# Altium project PCB_asurt.PrjPcb
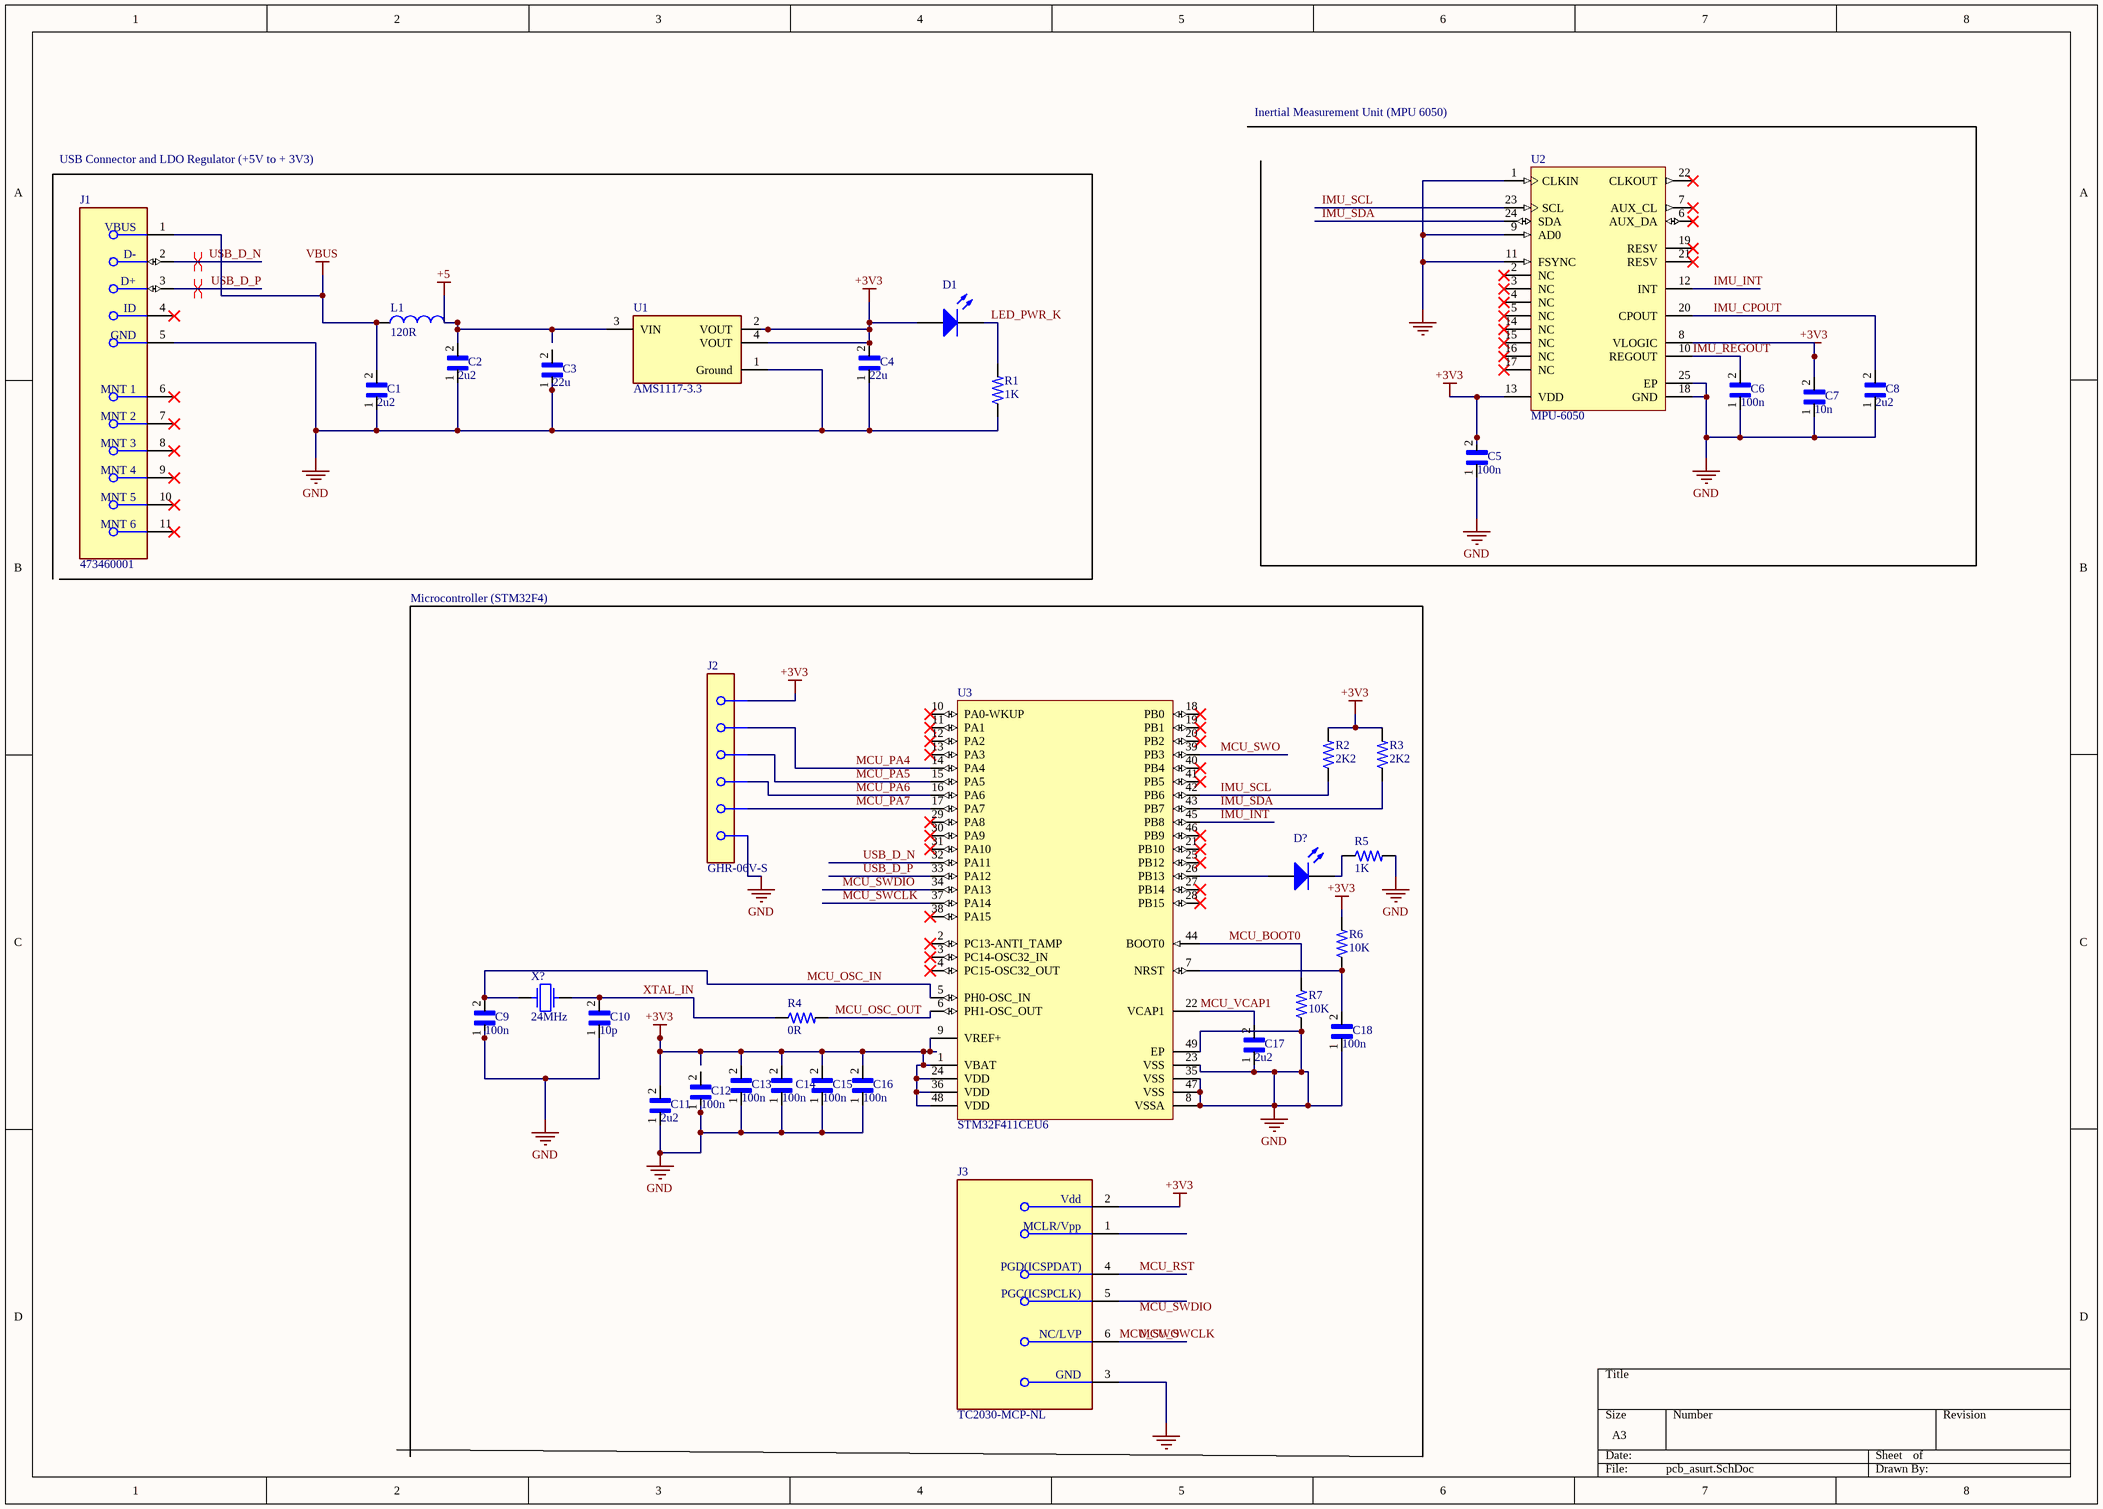
[diagram p0: pcb_asurt.SchDoc]
1 sheet, 35 parts. Net scope: global (net labels, ports and power ports of the same name join across sheets).
Board file: PCB1.PcbDoc

## Sheet pcb_asurt.SchDoc
size A3; SheetNumber: 1; SheetTotal: 1

### Parts
C1  2u2  [CAPRR1000W60L1260T920H1390]
C2  2u2  [CAPRR1000W60L1260T920H1390]
C3  22u  [CAPRR1000W60L1260T920H1390]
C4  22u  [CAPRR1000W60L1260T920H1390]
C5  100n  [CAPRR1000W60L1260T920H1390]
C6  100n  [CAPRR1000W60L1260T920H1390]
C7  10n  [CAPRR1000W60L1260T920H1390]
C8  2u2  [CAPRR1000W60L1260T920H1390]
C9  100n  [CAPRR1000W60L1260T920H1390]
C10  10p  [CAPRR1000W60L1260T920H1390]
C11  2u2  [CAPRR1000W60L1260T920H1390]
C12  100n  [CAPRR1000W60L1260T920H1390]
C13  100n  [CAPRR1000W60L1260T920H1390]
C14  100n  [CAPRR1000W60L1260T920H1390]
C15  100n  [CAPRR1000W60L1260T920H1390]
C16  100n  [CAPRR1000W60L1260T920H1390]
C17  2u2  [CAPRR1000W60L1260T920H1390]
C18  100n  [CAPRR1000W60L1260T920H1390]
D1  Light-Emitting Diode  (value not drawn)
D?  Light-Emitting Diode  (value not drawn)
J1  473460001  [FP-473460001-MFG]
J2  GHR-06V-S  [FP-GHR-06V-S-MFG]
J3  TC2030-MCP-NL  [FP-TC2030-MCP-NL-MFG]
L1  value 120R  (hidden comment: Inductor)
R1  1K  [RESC1005X35N]
R2  2K2  [RESC1005X35N]
R3  2K2  [RESC1005X35N]
R4  0R  [RESC1005X35N]
R5  1K  [RESC1005X35N]
R6  10K  [RESC1005X35N]
R7  10K  [RESC1005X35N]
U1  AMS1117-3.3  [FP-AMS1117-IPC_C]
U2  MPU-6050  [IS-QFN-24_V]
U3  STM32F411CEU6  [STM-UFQFPN48_L]
X?  F0: 24MHz  (hidden comment: Crystal)

### Nets
+3V3: C4.2 C5.2 C7.2 C11.2 C13.2 C14.2 C15.2 C16.2 D1.1(A) J3.2(Vdd) J3.3(GND) R2.2 R3.2 R6.2 U1.2(VOUT) U1.4(VOUT) U2.1(CLKIN) U2.8(VLOGIC) U2.9(AD0) U2.11(FSYNC) U2.13(VDD) U3.1(VBAT) U3.9(VREF+) U3.24(VDD) U3.36(VDD) U3.48(VDD)
+5: C2.2 L1.2 U1.3(VIN)
GND: C1.1 C2.1 C3.1 C4.1 C5.1 C6.1 C7.1 C8.1 C9.1 C10.1 C11.1 C12.1 C13.1 C14.1 C15.1 C16.1 C17.1 C18.1 J1.5(GND) R1.1 R5.2 R7.1 U1.1(Ground) U2.18(GND) U2.25(EP) U3.8(VSSA) U3.23(VSS) U3.35(VSS) U3.47(VSS) U3.49(EP)
VBUS: C1.2 J1.1(VBUS) L1.1
IMU_CPOUT: C8.2 U2.20(CPOUT)
IMU_INT: U2.12(INT) U3.45(PB8)
IMU_REGOUT: C6.2 U2.10(REGOUT)
IMU_SCL: R2.1 U2.23(SCL) U3.42(PB6)
IMU_SDA: R3.1 U2.24(SDA) U3.43(PB7)
LED_PWR_K: D1.2(K) R1.2
MCU_BOOT0: R7.2 U3.44(BOOT0)
MCU_OSC_IN: C9.2 U3.5(PH0-OSC_IN) X?.2
MCU_OSC_OUT: R4.2 U3.6(PH1-OSC_OUT)
MCU_PA4: U3.14(PA4)
MCU_PA5: U3.15(PA5)
MCU_PA6: U3.16(PA6)
MCU_PA7: U3.17(PA7)
MCU_RST: J3.4(PGD(ICSPDAT))
MCU_SWCLK: J3.6(NC/LVP) U3.37(PA14) U3.39(PB3)  [also labelled MCU_SWO]
MCU_SWDIO: U3.34(PA13)
MCU_VCAP1: C17.2 U3.22(VCAP1)
USB_D_N: J1.2(D-) U3.32(PA11)
USB_D_P: J1.3(D+) U3.33(PA12)
XTAL_IN: C10.2 R4.1 X?.1
NetC18_2: C18.2 R6.1 U3.7(NRST)
NetD?_1: D?.1(A) U3.26(PB13)
NetD?_2: D?.2(K) R5.1

Not connected (* = marked no-connect by the designer): C3 2; C12 2; J1 4(ID)* 6(MNT_1)* 7(MNT_2)* 8(MNT_3)* 9(MNT_4)* 10(MNT_5)* 11(MNT_6)*; J3 1(MCLR/Vpp) 5(PGC(ICSPCLK)); U2 2(NC)* 3(NC)* 4(NC)* 5(NC)* 6(AUX_DA)* 7(AUX_CL)* 14(NC)* 15(NC)* 16(NC)* 17(NC)* 19(RESV)* 21(RESV)* 22(CLKOUT)*; U3 2(PC13-ANTI_TAMP)* 3(PC14-OSC32_IN)* 4(PC15-OSC32_OUT)* 10(PA0-WKUP)* 11(PA1)* 12(PA2)* 13(PA3)* 18(PB0)* 19(PB1)* 20(PB2)* 21(PB10)* 25(PB12)* 27(PB14)* 28(PB15)* 29(PA8)* 30(PA9)* 31(PA10)* 38(PA15)* 40(PB4)* 41(PB5)* 46(PB9)*

### Layout directives
differential pair; differential pair class *DIFF_USB: USB_D_N, USB_D_P

### Notes on the sheet
- USB Connector and LDO Regulator (+5V to + 3V3)
- Inertial Measurement Unit (MPU 6050)
- Microcontroller (STM32F4)
- Labels drawn without touching a wire or pin: MCU_SWDIO

### Library data of the parts
C1-C18 = ECWFD2W105Q1: Price: None; Availability: Unavailable; Package: None; MP: ECWFD2W105Q1; Value: *
D1 D? = LED: AF: 1; BV: 0; BV_MAX: 1e99; EG: 1.11; FC: 0.5; IBV: 0.001; IS: 1e-14; MJSW: 0.33; NTUN: 30; TNOM: 27; XTI: 3; SimulationGenericComponent: True; CJO: 0; CJP: 0; CTA: 0; CTP: 0; FCS: 0.5; FV_MAX: 1e99; IKF: 0; IKR: 0; ISR: 1e-14; JSW: 0; JTUN: 0; JTUNSW: 0; KEG: 1; KF: 0; LEVEL: 1; N: 1; NBV: 1; NR: 1; NS: 1; PHP: 1; RS: 0; TCV: 0; TLEV: 0; TLEVC: 0; TM1: 0; TM2: 0; TPB: 0; TPHP: 0; TRS: 0; TRS2: 0; TT: 0; TTT1: 0; TTT2: 0; VJ: 1; XTITUN: 3
J1 = CMP-2000-05246-2: CONN RCPT USB2.0 MICRO B SMD R/A; Manufacturer: Molex; Conn Orientation: Right Angle; Is Female: yes; Shielding: true; Pitch: 0.65mm; Number Of Contacts: 5; Description: USB - micro B USB 2.0 Receptacle Connector 5 Position Surface Mount, Right Angle; Voltage Rating: 30V; Current Rating: 1.8A; Device Class L2: USB Connectors; Digikey Description: CONN RCPT USB2.0 MICRO B SMD R/A; Height: 2.945mm; RoHS: TRUE; ComponentLink2Description: Datasheet; Octopart: https://octopart.com/47346-0001-molex-7164928; Automotive: No; Package: 0; Category: Conn; Device Class L1: Connectors; Usb Standard: USB 2.0; Temperature: -30°C to +85°C; Temperature Range Low: -30°C; Footprint Url: https://www.molex.com/pdm_docs/sd/473460001_sd.pdf; ComponentLink2URL: https://www.molex.com/webdocs/datasheets/pdf/en-us/0473460001_IO_CONNECTORS.pdf; Lead Free: Yes; Manufacturer Part Number: 473460001; Contact Material: Gold,Nickel; Temperature Range High: +85°C; Device Class L3: unset
J2 = CMP-17439-000079-1: CONN GH HOUSING 6POS 1.25MM; Wire/Cable Gauge: 26AWG; Current Rating: 1A; Connector Type: Receptacle; Pitch: 0.049inch; Number of Contacts: 6; Voltage Rating (AC): 50V; Width: 4.15mm; Mount: Free Hanging; Fastening Type: Latch; REACH SVHC: No SVHC; Color: Natural; Housing Material: PBT; Contact Material: Bronze; Number of Rows: 1; Min Operating Temperature: -25°C; Contact Plating: Tin; Depth: 5.7mm; Housing Color: Natural; Termination: Crimp; Contact Type: Female Socket; Series: GH; Packaging: Bulk; Max Operating Temperature: 85°C; Number of Positions: 6; Lead Free: Lead Free; Length: 8.75mm
J3 = CMP-205963-000002-1: CABLE TAG-CONNECT IN-CIRCUIT; RoHS Compliant: Yes; Series: -; Reach SVHC Compliant: Yes; Package Quantity: 1; Lead Free: Lead Free
L1 = Inductor: SimulationGenericComponent: True
R1-R7 = 1-2176049-2: Fixed Resistor, Thick Film, 0.12; Power_Rating: .125 W; Resistance: .15; MF: TE Connectivity; Tolerance: 1%; SnapEDA_Link: https://www.snapeda.com/parts/1-2176049-2/TE+Connectivity/view-part/?ref=snap; Package: 0402; Value: *; MP: 1-2176049-2; EU_RoHS_Compliance: Compliant with Exemptions; Check_prices: https://www.snapeda.com/parts/1-2176049-2/TE+Connectivity/view-part/?ref=eda
U1 = CMP-209535-000001-1: LDO Voltage Regulators 1A, 3.3V; Manufacturer: Advanced Monolithic Systems; Dropout Voltage: 1.1V; Output Type: Fixed; Nominal Supply Current: 5mA; Max Power Dissipation: 1.2W; Max Supply Voltage: 15V; Number Of Outputs: 1; Standoff Height: 0.64mm; Max Junction Temp: +125°C; Height: 1.8mm; Package: AMS1117; Device Class L2: Power Management ICs; ComponentLink2Description: Datasheet; ComponentLink2URL: http://www.advanced-monolithic.com/pdf/ds1117.pdf; Category: IC; RoHS: TRUE; Automotive: No; Device Class L1: Integrated Circuits (ICs); Output Current: 1A; Device Class L3: Voltage Regulators - Linear; Temperature: -40°C to +125°C; Output Voltage: 3.3V; Manufacturer Part Number: AMS1117-3.3; Temperature Range Low: -40°C; Octopart: https://octopart.com/ams1117-3.3-advanced+monolithic+systems-25899300; Lead Free: Yes; Ipc Land Pattern Name: SOT229P700X180-4; Temperature Range High: +125°C
U2 = CMP-1753-00002-2: 3-Axis Gyroscope, Accelerometer and a Digital Motion Processor(TM) (DMP), 2.375 to 3.46 V, -40 to 85 degC, 24-Pin QFN, RoHS, Tape and Reel; Manufacturer: InvenSense; Featured Product: MPU-60506-Axis,IntegratedI²CSolution; Other Names: 1428-1007-2 / MPU6050; Sensor Type: MotionTracking; Online Catalog: MPU-6000™Series; Unit PriceUSD: Digital; Datasheet Version: Rev. 3.3, 05/2012; Category: Sensors,Transducers; Datasheet URL: http://datasheet.octopart.com/MPU-6050-InvenSense-datasheet-14421344.pdf; Family: Multifunction; Standard Package: 5,000; Manufacturer URL: http://www.invensense.com/; Output Type: Digital; Dynamic Catalog: MPU-6000™Series
U3 = CMP-0243-00165-1: ARM Cortex-M4 32-bit MCU+FPU, 512 KB Flash, 128 KB RAM, 36 I/Os, 48-Pin UFQFPN, -40 to 85 degC, Tray; Operating Frequency(F) (Processor speed) (MHz): 100; FLASH Size (Prog) (kB): 512; Internal RAM Size (kB): 128; I/Os (High Current): 36; Supply Voltage(Vcc) min (V): 1.7; Package Reference: 48-Pin Ultra Thin Fine Pitch Quad Flat No-Lead, 7 x 7 x 0.6 mm Body, 0.5 mm Pitch, Exposed Pad; ComponentLink1Description: Manufacturer URL; ComponentLink1URL: http://www.st.com/; Packing: Tray; Package Description: UFQFPN48; Core: ARM Cortex-M4; ComponentLink2Description: Datasheet; ComponentLink2URL: http://www.st.com/st-web-ui/static/active/en/resource/technical/document/datasheet/DM00115249.pdf; DatasheetVersion: Rev. 6; Mounting Technology: Surface Mount
X? = Crystal: R: 500; Q: 50K; SimulationGenericComponent: True